# EAGLE design lighting_sign (EAGLE 9.6.2)
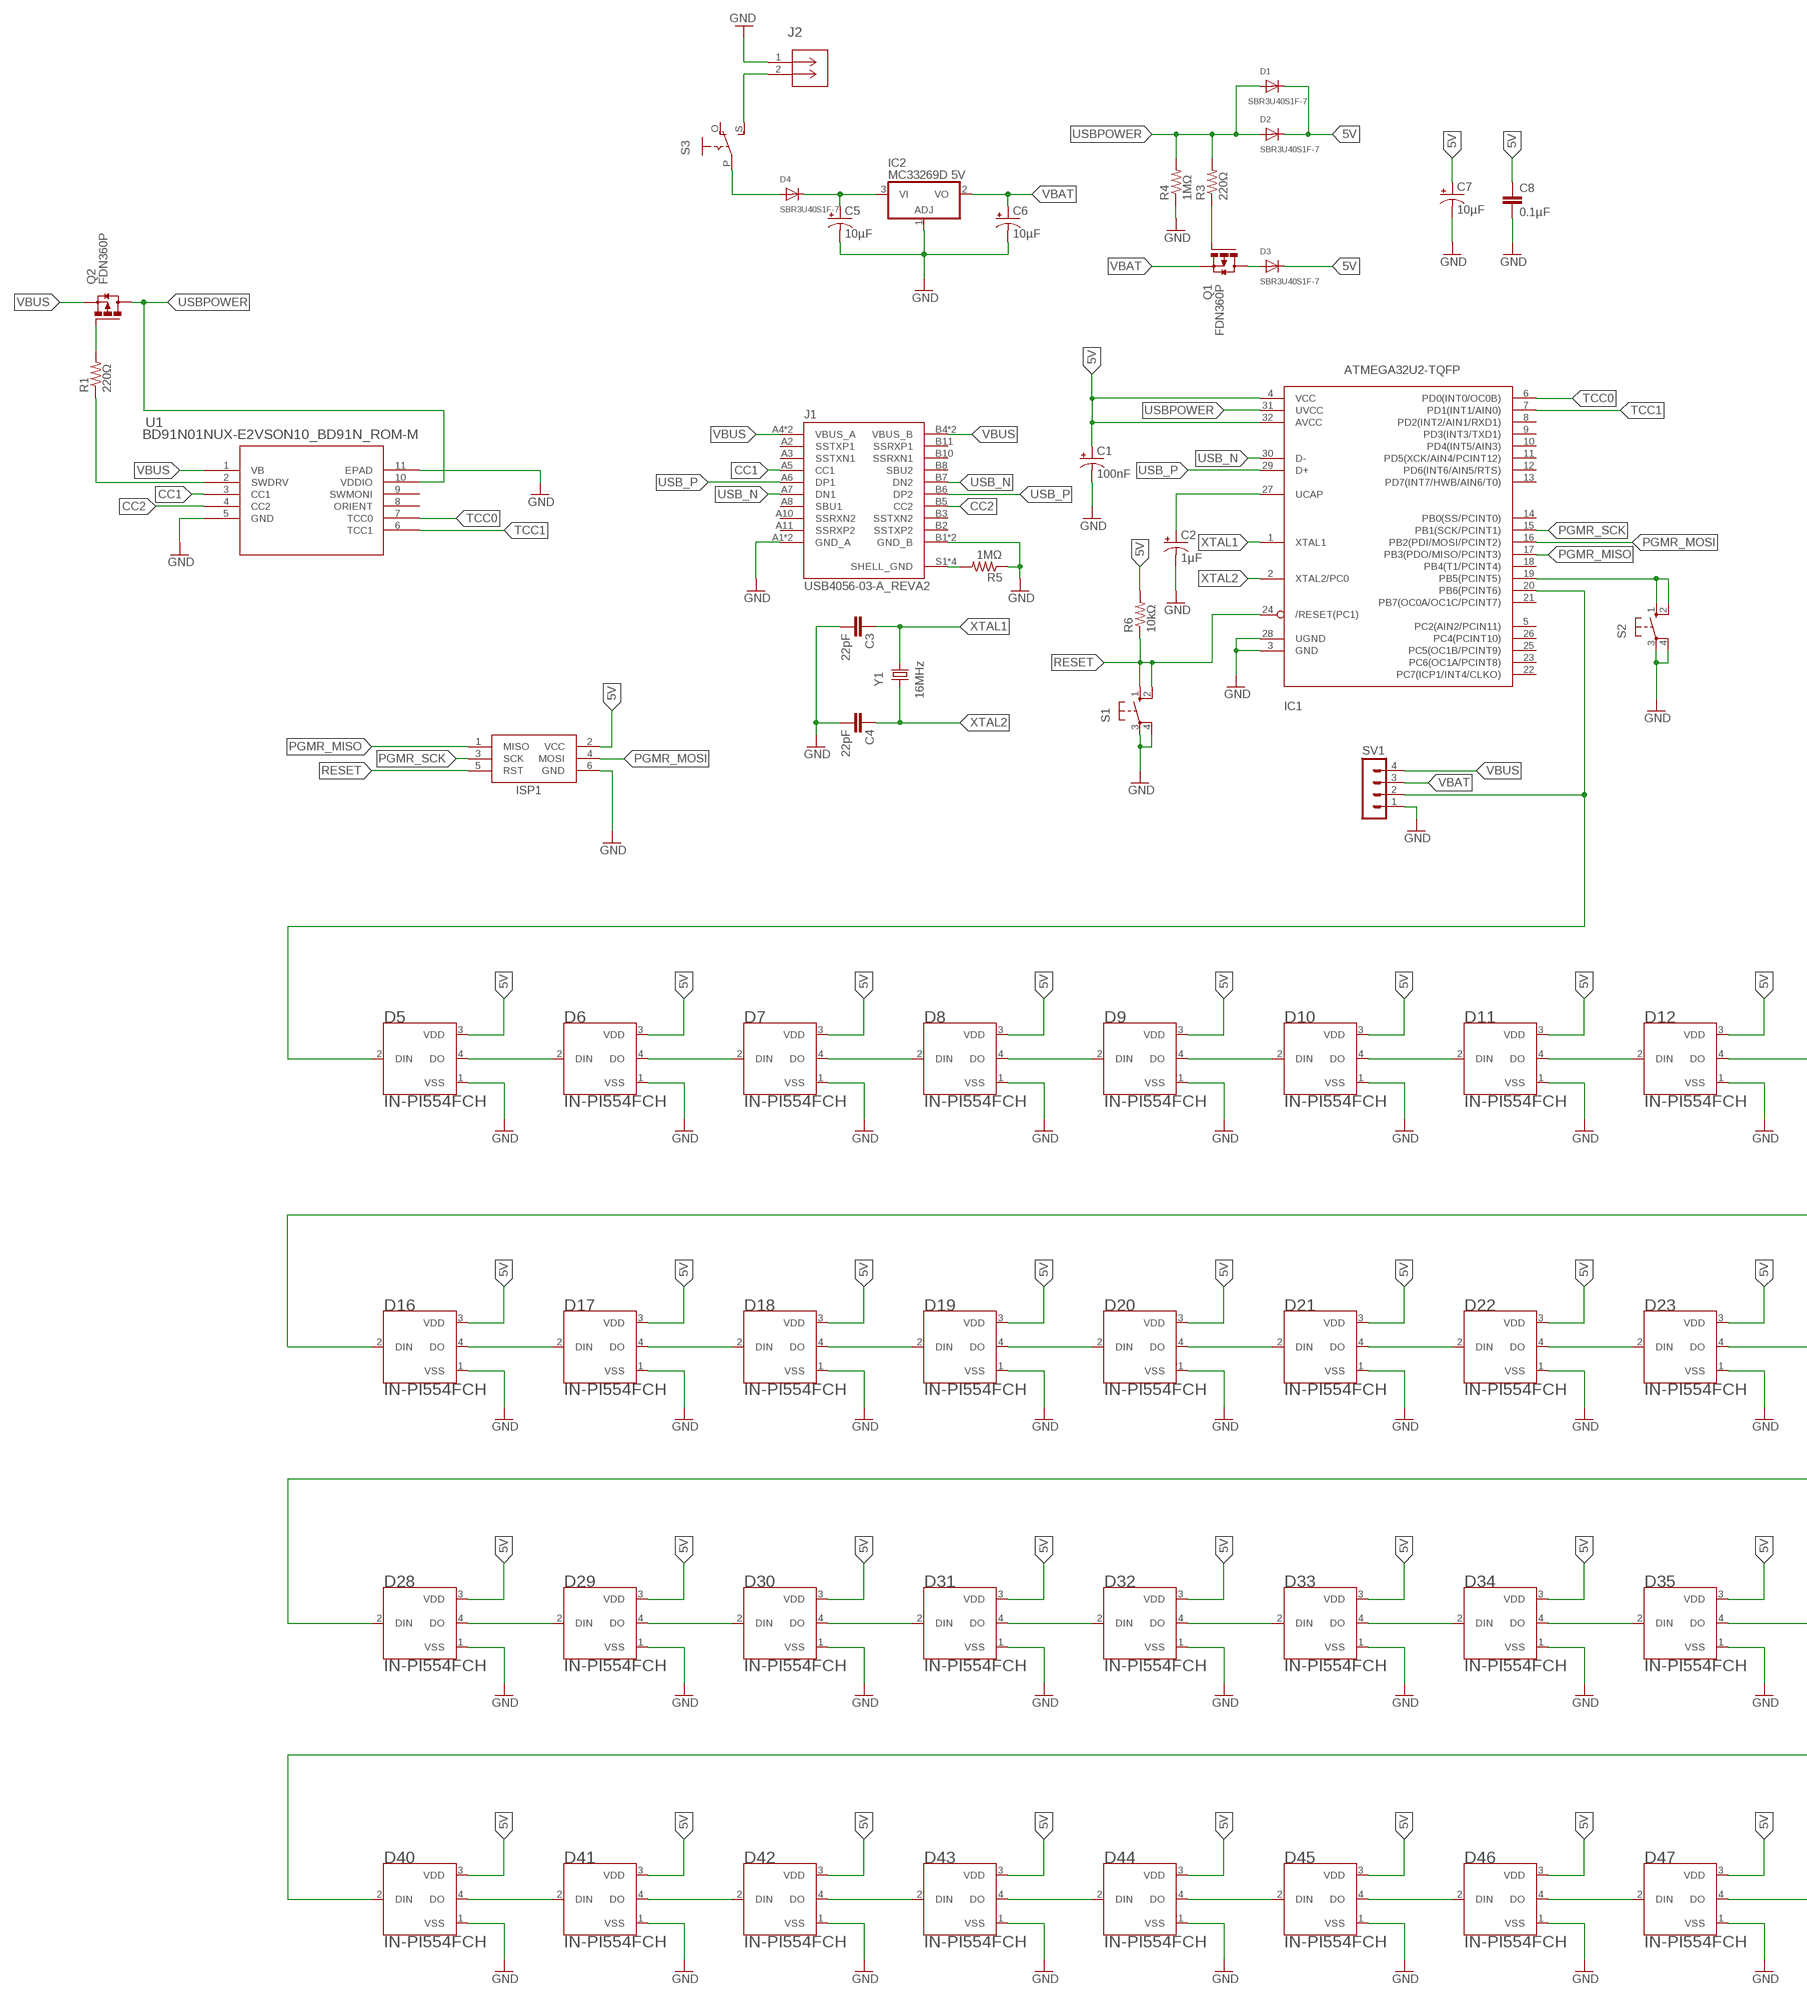
[diagram p0: schematic, sheet 1, part 1 of 2]
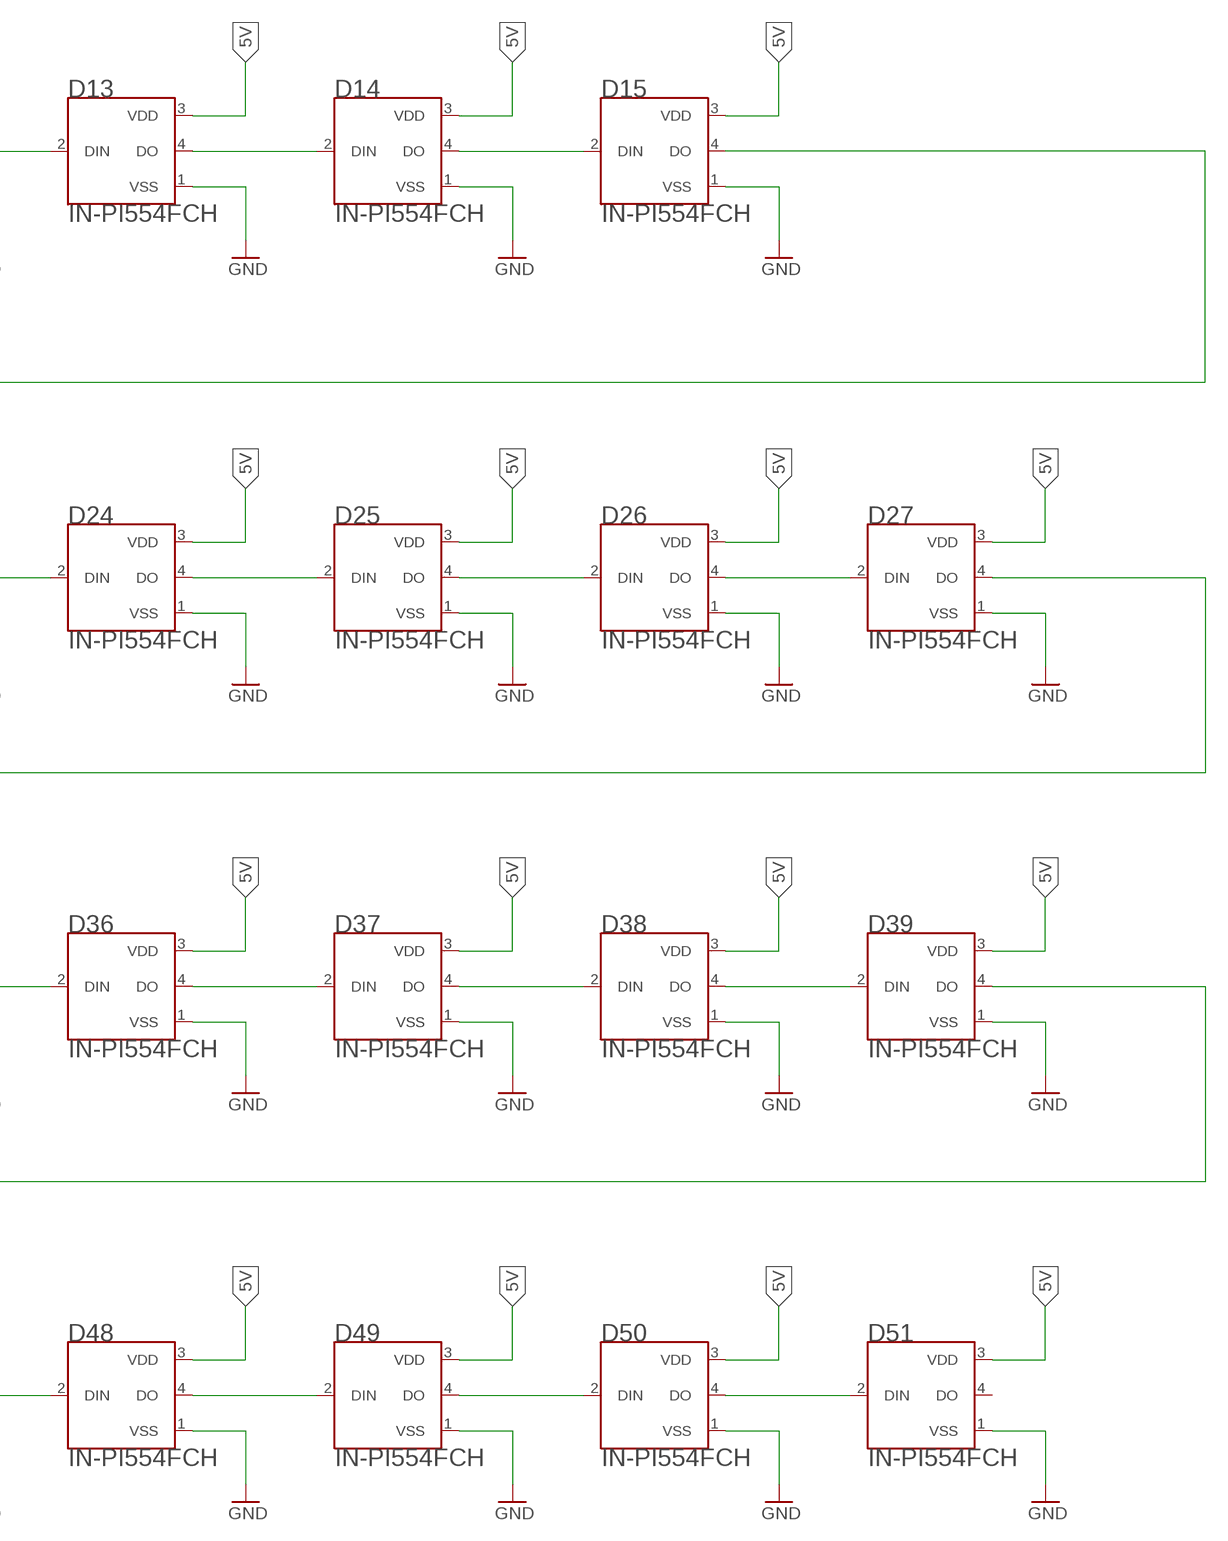
[diagram p1: schematic, sheet 1, part 2 of 2]

## Parts
C1  100nF  CPOL-USB  [PANASONIC_B]
C2  1µF  CPOL-USE2-5  [E2-5]
C3  22pF  C-EUC0402  [C0402]
C4  22pF  C-EUC0402  [C0402]
C5  10µF  CPOL-USB  [PANASONIC_B]
C6  10µF  CPOL-USB  [PANASONIC_B]
C7  10µF  CPOL-USB  [PANASONIC_B]
C8  0.1µF  C-EUC0402  [C0402]
D1  SBR3U40S1F-7  DIODESOD-123  [SOD-123]
D2  SBR3U40S1F-7  DIODESOD-123  [SOD-123]
D3  SBR3U40S1F-7  DIODESOD-123  [SOD-123]
D4  SBR3U40S1F-7  DIODESOD-123  [SOD-123]
D5  IN-PI554FCH  [LED_IN-PI554FCH]
D6  IN-PI554FCH  [LED_IN-PI554FCH]
D7  IN-PI554FCH  [LED_IN-PI554FCH]
D8  IN-PI554FCH  [LED_IN-PI554FCH]
D9  IN-PI554FCH  [LED_IN-PI554FCH]
D10  IN-PI554FCH  [LED_IN-PI554FCH]
D11  IN-PI554FCH  [LED_IN-PI554FCH]
D12  IN-PI554FCH  [LED_IN-PI554FCH]
D13  IN-PI554FCH  [LED_IN-PI554FCH]
D14  IN-PI554FCH  [LED_IN-PI554FCH]
D15  IN-PI554FCH  [LED_IN-PI554FCH]
D16  IN-PI554FCH  [LED_IN-PI554FCH]
D17  IN-PI554FCH  [LED_IN-PI554FCH]
D18  IN-PI554FCH  [LED_IN-PI554FCH]
D19  IN-PI554FCH  [LED_IN-PI554FCH]
D20  IN-PI554FCH  [LED_IN-PI554FCH]
D21  IN-PI554FCH  [LED_IN-PI554FCH]
D22  IN-PI554FCH  [LED_IN-PI554FCH]
D23  IN-PI554FCH  [LED_IN-PI554FCH]
D24  IN-PI554FCH  [LED_IN-PI554FCH]
D25  IN-PI554FCH  [LED_IN-PI554FCH]
D26  IN-PI554FCH  [LED_IN-PI554FCH]
D27  IN-PI554FCH  [LED_IN-PI554FCH]
D28  IN-PI554FCH  [LED_IN-PI554FCH]
D29  IN-PI554FCH  [LED_IN-PI554FCH]
D30  IN-PI554FCH  [LED_IN-PI554FCH]
D31  IN-PI554FCH  [LED_IN-PI554FCH]
D32  IN-PI554FCH  [LED_IN-PI554FCH]
D33  IN-PI554FCH  [LED_IN-PI554FCH]
D34  IN-PI554FCH  [LED_IN-PI554FCH]
D35  IN-PI554FCH  [LED_IN-PI554FCH]
D36  IN-PI554FCH  [LED_IN-PI554FCH]
D37  IN-PI554FCH  [LED_IN-PI554FCH]
D38  IN-PI554FCH  [LED_IN-PI554FCH]
D39  IN-PI554FCH  [LED_IN-PI554FCH]
D40  IN-PI554FCH  [LED_IN-PI554FCH]
D41  IN-PI554FCH  [LED_IN-PI554FCH]
D42  IN-PI554FCH  [LED_IN-PI554FCH]
D43  IN-PI554FCH  [LED_IN-PI554FCH]
D44  IN-PI554FCH  [LED_IN-PI554FCH]
D45  IN-PI554FCH  [LED_IN-PI554FCH]
D46  IN-PI554FCH  [LED_IN-PI554FCH]
D47  IN-PI554FCH  [LED_IN-PI554FCH]
D48  IN-PI554FCH  [LED_IN-PI554FCH]
D49  IN-PI554FCH  [LED_IN-PI554FCH]
D50  IN-PI554FCH  [LED_IN-PI554FCH]
D51  IN-PI554FCH  [LED_IN-PI554FCH]
IC1  ATMEGA32U2-TQFP  [TQFP32-08]
IC2  MC33269D 5V  MC33269D  [DPACK]
ISP1  AVRISP-BOX  [AVRISP-BOX]
J1  USB4056-03-A_REVA2  [GCT_USB4056-03-A_REVA2]
J2  BH9VPC 9V  BH9VPC  [CONN_BH9VPC_MPD]
Q1  FDN360P  [SUPER-SOT3]
Q2  FDN360P  [SUPER-SOT3]
R1  220Ω  R-US_0207/10  [0207/10]
R3  220Ω  R-US_0207/10  [0207/10]
R4  1MΩ  R-US_0207/10  [0207/10]
R5  1MΩ  R-US_0207/10  [0207/10]
R6  10kΩ  R-US_0207/10  [0207/10]
S1  10-XX  [B3F-10XX]
S2  10-XX  [B3F-10XX]
S3  EG1218S  [EG1218]
SV1  MA04-1  [MA04-1]
U1  BD91N01NUX-E2VSON10_BD91N_ROM-M  [VSON10_BD91N_ROM-M]
Y1  16MHz  CRYSTALHC49U-V  [HC49U-V]

## Nets
5V: C1.+ C7.+ C8.1 D1.C D2.C D3.C D5.3(VDD) D6.3(VDD) D7.3(VDD) D8.3(VDD) D9.3(VDD) D10.3(VDD) D11.3(VDD) D12.3(VDD) D13.3(VDD) D14.3(VDD) D15.3(VDD) D16.3(VDD) D17.3(VDD) D18.3(VDD) D19.3(VDD) D20.3(VDD) D21.3(VDD) D22.3(VDD) D23.3(VDD) D24.3(VDD) D25.3(VDD) D26.3(VDD) D27.3(VDD) D28.3(VDD) D29.3(VDD) D30.3(VDD) D31.3(VDD) D32.3(VDD) D33.3(VDD) D34.3(VDD) D35.3(VDD) D36.3(VDD) D37.3(VDD) D38.3(VDD) D39.3(VDD) D40.3(VDD) D41.3(VDD) D42.3(VDD) D43.3(VDD) D44.3(VDD) D45.3(VDD) D46.3(VDD) D47.3(VDD) D48.3(VDD) D49.3(VDD) D50.3(VDD) D51.3(VDD) IC1.4(VCC) IC1.32(AVCC) ISP1.2(VCC) R6.2
CC1: J1.A5(CC1) U1.3(CC1)
CC2: J1.B5(CC2) U1.4(CC2)
GND [GND]: C1.- C2.- C3.2 C4.2 C5.- C6.- C7.- C8.2 D5.1(VSS) D6.1(VSS) D7.1(VSS) D8.1(VSS) D9.1(VSS) D10.1(VSS) D11.1(VSS) D12.1(VSS) D13.1(VSS) D14.1(VSS) D15.1(VSS) D16.1(VSS) D17.1(VSS) D18.1(VSS) D19.1(VSS) D20.1(VSS) D21.1(VSS) D22.1(VSS) D23.1(VSS) D24.1(VSS) D25.1(VSS) D26.1(VSS) D27.1(VSS) D28.1(VSS) D29.1(VSS) D30.1(VSS) D31.1(VSS) D32.1(VSS) D33.1(VSS) D34.1(VSS) D35.1(VSS) D36.1(VSS) D37.1(VSS) D38.1(VSS) D39.1(VSS) D40.1(VSS) D41.1(VSS) D42.1(VSS) D43.1(VSS) D44.1(VSS) D45.1(VSS) D46.1(VSS) D47.1(VSS) D48.1(VSS) D49.1(VSS) D50.1(VSS) D51.1(VSS) IC1.3(GND) IC1.28(UGND) IC2.1(ADJ) ISP1.6(GND) J1.A1(GND_A) J1.A12(GND_A) J1.B1(GND_B) J1.B12(GND_B) J2.1 R4.1 R5.1 S1.3(P) S1.4(P1) S2.3(P) S2.4(P1) SV1.1 U1.5(GND) U1.11(EPAD)
N$2: D3.A Q1.3(D)
N$3: Q2.1(G) R1.2
N$4: Q1.1(G) R3.1
N$5: J2.2 S3.S
N$6: C5.+ D4.C IC2.3(VI)
N$7: D5.4(DO) D6.2(DIN)
N$8: D6.4(DO) D7.2(DIN)
N$9: D7.4(DO) D8.2(DIN)
N$10: D8.4(DO) D9.2(DIN)
N$11: D9.4(DO) D10.2(DIN)
N$12: D10.4(DO) D11.2(DIN)
N$13: D11.4(DO) D12.2(DIN)
N$14: J1.S1(SHELL_GND) J1.S2(SHELL_GND) J1.S3(SHELL_GND) J1.S4(SHELL_GND) R5.2
N$15: D5.2(DIN) IC1.20(PB6(PCINT6)) SV1.2
N$16: C2.+ IC1.27(UCAP)
N$17: D4.A S3.P
N$18: IC1.19(PB5(PCINT5)) S2.1(S) S2.2(S1)
N$19: D12.4(DO) D13.2(DIN)
N$20: D13.4(DO) D14.2(DIN)
N$21: D14.4(DO) D15.2(DIN)
N$22: D16.4(DO) D17.2(DIN)
N$23: D17.4(DO) D18.2(DIN)
N$24: D18.4(DO) D19.2(DIN)
N$25: D19.4(DO) D20.2(DIN)
N$26: D20.4(DO) D21.2(DIN)
N$27: D21.4(DO) D22.2(DIN)
N$28: D22.4(DO) D23.2(DIN)
N$29: D15.4(DO) D16.2(DIN)
N$30: D23.4(DO) D24.2(DIN)
N$31: D24.4(DO) D25.2(DIN)
N$32: D25.4(DO) D26.2(DIN)
N$33: D26.4(DO) D27.2(DIN)
N$34: D28.4(DO) D29.2(DIN)
N$35: D29.4(DO) D30.2(DIN)
N$36: D30.4(DO) D31.2(DIN)
N$37: D31.4(DO) D32.2(DIN)
N$38: D32.4(DO) D33.2(DIN)
N$39: D33.4(DO) D34.2(DIN)
N$40: D34.4(DO) D35.2(DIN)
N$41: D27.4(DO) D28.2(DIN)
N$42: D35.4(DO) D36.2(DIN)
N$43: D36.4(DO) D37.2(DIN)
N$44: D37.4(DO) D38.2(DIN)
N$45: D38.4(DO) D39.2(DIN)
N$46: D39.4(DO) D40.2(DIN)
N$47: D40.4(DO) D41.2(DIN)
N$48: D41.4(DO) D42.2(DIN)
N$49: D42.4(DO) D43.2(DIN)
N$50: D43.4(DO) D44.2(DIN)
N$51: D44.4(DO) D45.2(DIN)
N$52: D45.4(DO) D46.2(DIN)
N$53: D46.4(DO) D47.2(DIN)
N$55: D47.4(DO) D48.2(DIN)
N$56: D48.4(DO) D49.2(DIN)
N$57: D49.4(DO) D50.2(DIN)
N$58: D50.4(DO) D51.2(DIN)
N$59: R1.1 U1.2(SWDRV)
PGMR_MISO: IC1.17(PB3(PDO/MISO/PCINT3)) ISP1.1(MISO)
PGMR_MOSI: IC1.16(PB2(PDI/MOSI/PCINT2)) ISP1.4(MOSI)
PGMR_SCK: IC1.15(PB1(SCK/PCINT1)) ISP1.3(SCK)
RESET: IC1.24(/RESET(PC1)) ISP1.5(RST) R6.1 S1.1(S) S1.2(S1)
TCC0: IC1.6(PD0(INT0/OC0B)) U1.7(TCC0)
TCC1: IC1.7(PD1(INT1/AIN0)) U1.6(TCC1)
USB_N [diff pairs]: IC1.30(D-) J1.A7(DN1) J1.B7(DN2)
USB_P [diff pairs]: IC1.29(D+) J1.A6(DP1) J1.B6(DP2)
USBPOWER: D1.A D2.A IC1.31(UVCC) Q2.3(D) R3.2 R4.2 U1.10(VDDIO)
VBAT: C6.+ IC2.2(VO) Q1.2(S) SV1.3
VBUS: J1.A4(VBUS_A) J1.A9(VBUS_A) J1.B4(VBUS_B) J1.B9(VBUS_B) Q2.2(S) SV1.4 U1.1(VB)
XTAL1: C3.1 IC1.1(XTAL1) Y1.2
XTAL2: C4.1 IC1.2(XTAL2/PC0) Y1.1
Unconnected: D51.4(DO) IC1.5(PC2(AIN2/PCIN11)) IC1.8(PD2(INT2/AIN1/RXD1)) IC1.9(PD3(INT3/TXD1)) IC1.10(PD4(INT5/AIN3)) IC1.11(PD5(XCK/AIN4/PCINT12)) IC1.12(PD6(INT6/AIN5/RTS)) IC1.13(PD7(INT7/HWB/AIN6/T0)) IC1.14(PB0(SS/PCINT0)) IC1.18(PB4(T1/PCINT4)) IC1.21(PB7(OC0A/OC1C/PCINT7)) IC1.22(PC7(ICP1/INT4/CLKO)) IC1.23(PC6(OC1A/PCINT8)) IC1.25(PC5(OC1B/PCINT9)) IC1.26(PC4(PCINT10)) J1.A2(SSTXP1) J1.A3(SSTXN1) J1.A8(SBU1) J1.A10(SSRXN2) J1.A11(SSRXP2) J1.B2(SSTXP2) J1.B3(SSTXN2) J1.B8(SBU2) J1.B10(SSRXN1) J1.B11(SSRXP1) S3.O U1.8(ORIENT) U1.9(SWMONI)

## Library data of the parts
C1 C2 C5-C7 = adafruit:CPOL-US: POLARIZED CAPACITOR, American symbol
C3 C4 C8 = rcl:C-EU: CAPACITOR, European symbol; SPICEPREFIX: C
D1-D4 = adafruit:DIODE: Diode SMADIODE - SMA Surface Mount Package 20V 1A Schottky Diode Digikey: 641-1014-6-ND DO-1N4148 - Through Hole Small Current Diode SOD-123 20V 1 A (.5mV Vf) Schottky Diode - Digikey: MBRX120TPMSCT-ND SOD-323 10V 570mA (.38mV Vf, 3ns) Schottky Diode - Digikey: ZLLS410CT-ND SOD-523 30V 30mA Schottky Diode (RB751S-40TE61) - Digikey: RB751S-40TE61CT-ND SOT23-R/W - SOT23 Package (R = Solder Paste/Reflow Ovens, W = Hand-Soldering) BAT54Film 40V 300mA - Digikey: 497-7162-1-ND
D5-D51 = IN-PI554FCH:IN-PI554FCH: 5050RGB with integrated IC built in 4 PIN Viewing angle: 120 degrees; MANUFACTURER: Inolux
IC1 = adafruit:ATMEGA32U2: ATmega32u2 Pin compatible with the atmega8u2, atmega16u2 and atmega32u2 8, 16 or 32 K flash, 1K RAM, 512b EEPROM 8 bit and 16 bit timer (5 PWM total) UART, SPI (no I2C!) USB with 4 endpoints, LUFA compatible 22 I/O lines, analog comparator (no ADC!) Comes with DFU bootloader burned in!
IC2 = linear:MC33269?*: Adjustable Output Low Dropout Voltage Regulator 800 mA Source: http://www.onsemi.com/pub/Collateral/MC33269-D.PDF
ISP1 = adafruit:AVRISP: AVR ISP HEADER Standard 6 pin header for AVR programming
J1 = USB4056-03-A_REVA2:USB4056-03-A_REVA2; MANUFACTURER: GCT; MAXIMUM_PACKAGE_HEIGHT: 3.31 mm; PARTREV: A2; SNAPEDA_PN: USB4056-03-A; STANDARD: Manufacturer Recommendations
J2 = components:BH9VPC; COPYRIGHT: Copyright (C) 2024 Ultra Librarian. All rights reserved.; MANUFACTURER_PART_NUMBER: BH9VPC; MFR_NAME: Memory Protection Devices
Q1 Q2 = transistor-power:FDN360P: Single P-Channel, PowerTrench (R) MOSFET Source: http://www.fairchildsemi.com/ds/FD/FDN360P.pdf
R1 R3-R6 = adafruit:R-US_: RESISTOR, American symbol
S1 S2 = switch-omron:10-XX: OMRON SWITCH; MPN: B3F-1000; OC_FARNELL: 176432; OC_NEWARK: 36M3542
S3 = adafruit:EG1218: SLIDING SWITCH 0.1" spacing through hole, vertical SPDT slide switch http://www.ladyada.net/library/pcb/eaglelibrary.html
SV1 = con-lstb:MA04-1: PIN HEADER; OC_FARNELL: unknown; OC_NEWARK: unknown
U1 = components:BD91N01NUX-E2; COPYRIGHT: Copyright (C) 2025 Ultra Librarian. All rights reserved.; MANUFACTURER_PART_NUMBER: BD91N01NUX-E2; MFR_NAME: ROHM Semiconductor
Y1 = crystal:CRYSTAL: CRYSTAL; OC_FARNELL: 1666969; OC_NEWARK: unknown

## Net classes
1 diff pairs: width 0.203 mm
2 GND: clearance 0.254 mm to class 1

## Board
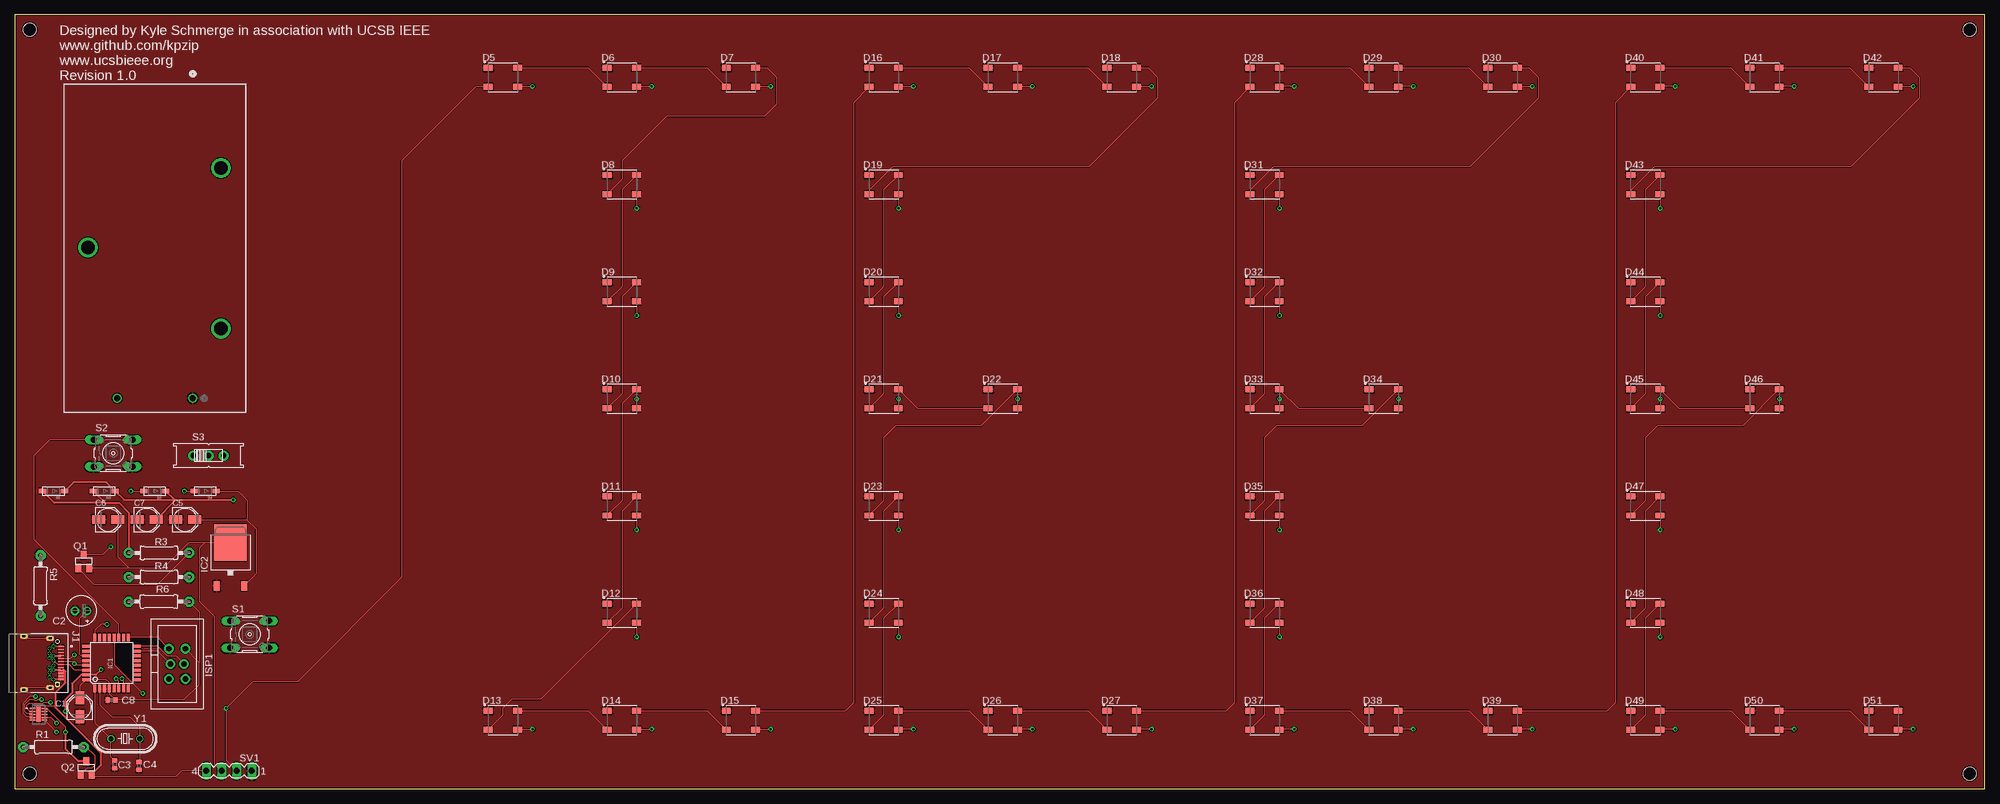
[diagram p2: board, top side]
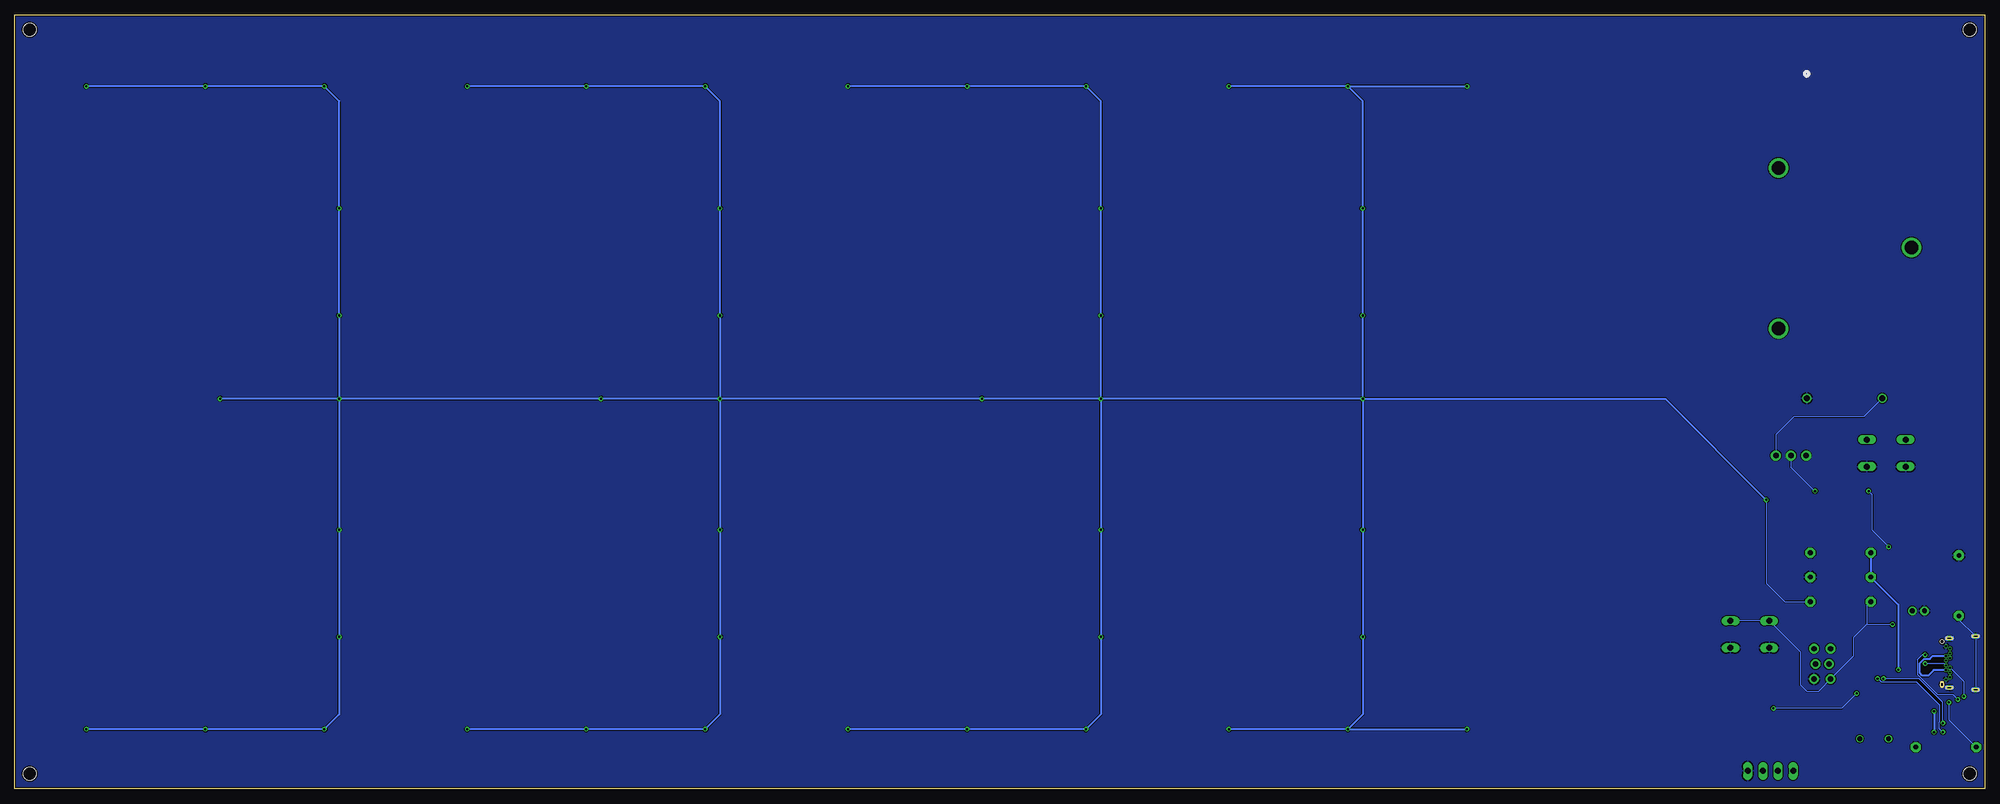
[diagram p3: board, bottom side, seen from below]

Size 331 x 130 mm. Coordinates in mm from the lower left corner, seen from the top.
Outline: 0,0 331,0 331,130 0,130 0,0
Copper layers (1*16): Top 0.035mm / dielectric 1.5mm / Bottom 0.035mm
Design rules "default *": minimum track width 6mil, minimum drill 0.35mm, track to track 6mil, track to pad 6mil, pad to pad 6mil, via to via 6mil, smd to smd 6mil, copper to edge 10mil, drill to drill 6mil, minimum pad ring 0.1mm, minimum via ring 8mil, stop-mask expansion 4mil, vias tented up to drill 0mil, thermal gap 10mil
Holes 2.2 mm at 2.5,127.5 328.5,127.5 328.5,2.5 2.5,2.5

### Footprints (pad centres in the part's own frame; a part is rotated, then mirrored left to right if it is on the bottom)
PANASONIC_B = smd 2.2 x 1.4: + 1.6,0; - -1.6,0
E2-5 = drill 0.813 pad 1.422: + -1.016,0 | drill 0.813 pad 1.422 octagon: - 1.016,0
C0402 = smd 0.7 x 0.9: 1 -0.65,0; 2 0.65,0
SOD-123 = smd 1.2 x 0.7: A 1.85,0; C -1.85,0
LED_IN-PI554FCH = smd 1.5 x 1: 1 -2.45,1.6; 2 -2.45,-1.6; 3 2.45,-1.6; 4 2.45,1.6
TQFP32-08 = smd 1.27 x 0.508: 1 -4.293,2.8; 2 -4.293,2; 3 -4.293,1.2; 4 -4.293,0.4; 5 -4.293,-0.4; 6 -4.293,-1.2; 7 -4.293,-2; 8 -4.293,-2.8; 17 4.293,-2.8; 18 4.293,-2; 19 4.293,-1.2; 20 4.293,-0.4; 21 4.293,0.4; 22 4.293,1.2; 23 4.293,2; 24 4.293,2.8 | smd 0.508 x 1.27: 9 -2.8,-4.293; 10 -2,-4.293; 11 -1.2,-4.293; 12 -0.4,-4.293; 13 0.4,-4.293; 14 1.2,-4.293; 15 2,-4.293; 16 2.8,-4.293; 25 2.8,4.293; 26 2,4.293; 27 1.2,4.293; 28 0.4,4.293; 29 -0.4,4.293; 30 -1.2,4.293; 31 -2,4.293; 32 -2.8,4.293
DPACK = smd 1 x 1.6: 1 -2.28,-4.8; 3 2.28,-4.8 | smd 5.4 x 6.2: 2 0,2.5
AVRISP-BOX = drill 0.9 pad 1.626: 1 -1.397,2.54; 2 1.397,2.54; 3 -1.143,0; 4 1.143,0; 5 -1.397,-2.54; 6 1.397,-2.54
GCT_USB4056-03-A_REVA2 = smd 0.3 x 0.9: A1 -2.75,6.2; A2 -2.25,6.2; A3 -1.75,6.2; A4 -1.25,6.2; A5 -0.75,6.2; A6 -0.25,6.2; A7 0.25,6.2; A8 0.75,6.2; A9 1.25,6.2; A10 1.75,6.2; A11 2.25,6.2; A12 2.75,6.2 | drill 0.4 pad 0.6: B1 2.8,4.99; B2 2.4,4.29; B3 1.6,4.29; B4 1.2,4.99; B5 0.8,4.29; B6 0.4,4.99; B7 -0.4,4.99; B8 -0.8,4.29; B9 -1.2,4.99; B10 -1.6,4.29; B11 -2.4,4.29; B12 -2.8,4.99 | drill 0.5 pad 0.8: S1 -4.13,4.4; S2 4.13,4.4; S3 -4.49,0; S4 4.49,0 | hole 0.65: 3.6,5.64; -3.6,5.64
CONN_BH9VPC_MPD = drill 1.016 pad 1.524: 1 0,0; 2 0,-12.7 | drill 2.286 pad 2.286: 3 -38.684,4.75; 4 -11.709,4.75; 5 -25.349,-17.602
SUPER-SOT3 = smd 1 x 1.4: 1 -0.95,-1.1; 2 0.95,-1.1; 3 0,1.1
0207/10 = drill 0.813 pad 1.676 octagon: 1 -5.08,0; 2 5.08,0
B3F-10XX = drill 1.016 long: 1 -3.251,2.261; 2 3.251,2.261; 3 -3.251,-2.261; 4 3.251,-2.261
EG1218 = drill 0.9 pad 1.676: O -2.54,0; P 0,0; S 2.54,0
MA04-1 = drill 1.016 long: 1 -3.81,0; 2 -1.27,0; 3 1.27,0; 4 3.81,0
VSON10_BD91N_ROM-M = smd 0.914 x 0.254: 1 -1.003,1; 2 -1.003,0.5; 3 -1.003,0; 4 -1.003,-0.5; 5 -1.003,-1; 6 1.003,-1; 7 1.003,-0.5; 8 1.003,0; 9 1.003,0.5; 10 1.003,1 | smd 0.737 x 2.489: 11 0,0
HC49U-V = drill 0.813: 1 -2.413,0; 2 2.413,0

### Placement (x,y rotation side)
C1  10.91,13.67 90 top
C2  11.13,29.88 180 top
C3  16.78,4.09 270 top
C4  20.85,3.83 270 top
C5  28.61,45.21 0 top
C6  15.66,45.21 0 top
C7  22.16,45.21 0 top
C8  16.26,14.91 180 top
D1  6.5,50 180 top
D2  15,50 180 top
D3  23.5,50 180 top
D4  32,50 180 top
D5  82,119.5 0 top
D6  102,119.5 0 top
D7  122,119.5 0 top
D8  102,101.5 0 top
D9  102,83.5 0 top
D10  102,65.5 0 top
D11  102,47.5 0 top
D12  102,29.5 0 top
D13  82,11.5 0 top
D14  102,11.5 0 top
D15  122,11.5 0 top
D16  146,119.5 0 top
D17  166,119.5 0 top
D18  186,119.5 0 top
D19  146,101.5 0 top
D20  146,83.5 0 top
D21  146,65.5 0 top
D22  166,65.5 0 top
D23  146,47.5 0 top
D24  146,29.5 0 top
D25  146,11.5 0 top
D26  166,11.5 0 top
D27  186,11.5 0 top
D28  210,119.5 0 top
D29  230,119.5 0 top
D30  250,119.5 0 top
D31  210,101.5 0 top
D32  210,83.5 0 top
D33  210,65.5 0 top
D34  230,65.5 0 top
D35  210,47.5 0 top
D36  210,29.5 0 top
D37  210,11.5 0 top
D38  230,11.5 0 top
D39  250,11.5 0 top
D40  274,119.5 0 top
D41  294,119.5 0 top
D42  314,119.5 0 top
D43  274,101.5 0 top
D44  274,83.5 0 top
D45  274,65.5 0 top
D46  294,65.5 0 top
D47  274,47.5 0 top
D48  274,29.5 0 top
D49  274,11.5 0 top
D50  294,11.5 0 top
D51  314,11.5 0 top
IC1  16.26,21.12 90 top
IC2  36.23,38.86 0 top
ISP1  27.27,20.97 0 top
J1  1.52,21.12 270 top
J2  29.89,65.57 270 top
Q1  11.57,38.19 0 top
Q2  12,3.5 0 top
R1  6.5,7 0 top
R3  24.2,39.62 180 top
R4  24.2,35.56 180 top
R5  4.31,34.1 270 top
R6  24.22,31.42 0 top
S1  39.47,25.93 0 top
S2  16.54,56.37 0 top
S3  32.54,55.97 0 top
SV1  35.99,3 180 top
U1  4,12.5 0 top
Y1  18.56,8.4 180 top

### Tracks (layer width: path | path; a pad name or v marks a point on that pad's centre or on a via)
5V  (via drill 0.35)
  Top 0.152: C1.+ 10.91,17.27 IC1.32 15.38,18.32 15.86,17.85 IC1.4 15.86,15.96 C8.1 28.41,14.91 31,17.5 31,21.18 | v296.5,65.5 296.5,63.95 D46.3 | v276.5,65.5 276.5,63.95 D45.3 | v104.5,65.5 104.5,63.95 D10.3 | v148.5,65.5 148.5,63.95 D21.3 | v168.5,65.5 168.5,63.95 D22.3 | v212.5,65.5 212.5,63.95 D33.3 | v232.5,65.5 232.5,63.95 D34.3 | D16.3 148.55,118 v151,118 | D17.3 168.55,118 v171,118 | D25.3 148.55,10 v151,10 | D26.3 168.55,10 v171,10 | D27.3 188.55,10 v191,10 | D37.3 212.55,10 v215,10 | D38.3 232.55,10 v235,10 | D39.3 252.55,10 v255,10 | D49.3 276.55,10 v279,10 | D50.3 296.55,10 v299,10 | D51.3 316.55,10 v319,10 | D41.3 296.55,118 v299,118 | D40.3 276.55,118 v279,118 | D28.3 212.55,118 v215,118 | D29.3 232.55,118 v235,118 | D18.3 188.55,118 v191,118 | D30.3 252.55,118 v255,118 | D42.3 316.55,118 v319,118 | D47.3 276.5,45.85 v276.5,43.5 | D48.3 276.5,27.85 v276.5,25.5 | D44.3 276.5,81.85 v276.5,79.5 | D43.3 276.5,99.85 v276.5,97.5 | D36.3 212.5,27.85 v212.5,25.5 | D35.3 212.5,45.85 v212.5,43.5 | D32.3 212.5,81.85 v212.5,79.5 | D31.3 212.5,99.85 v212.5,97.5 | D19.3 148.5,99.85 v148.5,97.5 | D20.3 148.5,81.85 v148.5,79.5 | D23.3 148.5,45.85 v148.5,43.5 | D24.3 148.5,27.85 v148.5,25.5 | D5.3 84.55,118 v87,118 | D6.3 104.55,118 v107,118 | D7.3 124.55,118 v127,118 | D8.3 104.5,99.85 v104.5,97.5 | D9.3 104.5,81.85 v104.5,79.5 | D11.3 104.5,45.85 v104.5,43.5 | D12.3 104.5,27.85 v104.5,25.5 | D14.3 104.55,10 v107,10 | D15.3 124.55,10 v127,10 | D13.3 84.55,10 v87,10 | 31,21.18 ISP1.2 | R6.2 31,29.72 31,21.18
  Top 0.305: 26.84,48.51 18.34,48.51 D2.C 15.35,51.5 9.85,51.5 D1.C | v36.69,48.51 27.5,48.51 27.07,48.51 | D3.C 26.84,48.51 | 26.84,48.51 27.07,48.51 | C7.+ 27.07,48.51
  Bottom 0.152: v36.69,48.51 v36.69,48.5 36.69,34.5 33.61,31.42 R6.2
  Bottom 0.305: v104.5,65.5 v148.5,65.5 | v148.5,65.5 v168.5,65.5 v212.5,65.5 | v212.5,65.5 v232.5,65.5 v276.5,65.5 | v276.5,65.5 v296.5,65.5 | v148.5,65.5 v148.5,79.5 v148.5,97.5 148.5,115.5 v151,118 v171,118 v191,118 | v255,118 v235,118 v215,118 212.5,115.5 v212.5,97.5 v212.5,79.5 v212.5,65.5 | v148.5,65.5 v148.5,43.5 v148.5,25.5 148.5,12.5 v151,10 v171,10 v191,10 | v212.5,65.5 v212.5,43.5 v212.5,25.5 212.5,12.5 v215,10 v235,10 v255,10 | v276.5,65.5 v276.5,43.5 v276.5,25.5 276.5,12.5 v279,10 v299,10 v319,10 | v104.5,65.5 v104.5,79.5 v104.5,97.5 104.5,115.5 v107,118 | v107,118 v127,118 | v107,118 v87,118 | v104.5,65.5 v104.5,43.5 v104.5,25.5 104.5,12.5 v107,10 | v107,10 v127,10 | v107,10 v87,10 | v36.69,48.5 53.69,65.5 v104.5,65.5 | v319,118 v299,118 v279,118 276.5,115.5 v276.5,97.5 v276.5,79.5 v276.5,65.5
CC1  (via drill 0.35)
  Top 0.152: J1.A5 9.37,21.87 v10,22.5 | U1.3 2.85,12.64 1.97,12.64 1.62,13 1.62,14.12 2.5,15 3.14,15 3.25,14.89 3.75,14.89 3.86,15 v4.5,15
  Bottom 0.152: v10,22.5 10.5,22.5 11.32,21.68 11.32,19.25 7.93,15.87 5.37,15.87 v4.5,15
CC2  (via drill 0.35)
  Top 0.152: U1.4 2.85,12.14 1.95,12.14 1.31,12.78 1.31,14.31 2.5,15.5 v3.5,15.5
  Bottom 0.152: J1.B5 3.5,18.01 v3.5,15.5
GND
  Top 0.152: J1.A12 6.56,18.37 J1.B1 | J1.A1 6.56,23.87 J1.B12
  pour Top: -6.35,-6.35 343.87,-6.35 343.87,156.68 -6.35,156.68
  pour Bottom: -6.35,156.69 -6.35,-4.13 343.85,-4.13 343.85,156.69
N$2  (via drill 0.35)
  Top 0.152: v16.12,40.64 14.77,39.29 Q1.3 | v19.5,50 D3.A
  Bottom 0.152: v16.12,40.64 18.91,43.43 18.91,49.41 v19.5,50
N$3
  Top 0.152: Q2.1 12.15,3.5 13,3.5 13.5,4 13.5,5.5 12,7 R1.2
N$4
  Top 0.152: R3.1 23.94,34.29 13.36,34.29 10.62,37.04 Q1.1
N$5
  Bottom 0.152: S3.S 35.08,59.5 32.08,62.5 20.27,62.5 J2.2
N$6
  Top 0.152: C5.+ 38.98,45.21 | IC2.3 40.55,36.1 40.55,43.64 38.98,45.21 | D4.C 37.5,50 39,48.5 39,45.24 38.98,45.21
N$7
  Top 0.152: D5.4 96.35,121.1 D6.2
N$8
  Top 0.152: D6.4 116.35,121.1 D7.2
N$9
  Top 0.152: D7.4 126.4,121.1 128,119.5 128,115 126,113 109.5,113 102,105.5 102,102.35 D8.2
N$10
  Top 0.152: D8.4 102,100.65 102,84.35 D9.2
N$11
  Top 0.152: D9.4 102,82.65 102,66.35 D10.2
N$12
  Top 0.152: D10.4 102,64.65 102,48.35 D11.2
N$13
  Top 0.152: D11.4 102,46.65 102,30.35 D12.2
N$14
  Top 0.152: J1.S2 1.88,16.99 J1.S4 | J1.S3 1.88,25.25 J1.S1
  Bottom 0.152: J1.S4 J1.S3 4.31,28.4 R5.2
N$15  (via drill 0.35)
  Top 0.152: IC1.20 16.66,20.84 v21.5,16 | SV1.2 35.5,4.76 v35.5,13.5 40,18 47.5,18 65,35.5 65,105.5 77.4,117.9 D5.2
  Bottom 0.152: v21.5,16 24,13.5 v35.5,13.5
N$16
  Top 0.152: IC1.27 11.12,22.32 10.92,22.53 10.92,28.65 C2.+
N$17  (via drill 0.35)
  Top 0.152: v28.5,50 D4.A
  Bottom 0.152: S3.P 32.54,54.04 v28.5,50
N$18
  Top 0.152: S2.2 S2.1 5.88,58.63 3.29,56.05 3.29,41.81 17.46,27.65 IC1.19
N$19
  Top 0.152: D12.4 88.35,15 83.5,15 82,13.5 82,12.35 D13.2
N$20
  Top 0.152: D13.4 96.35,13.1 D14.2
N$21
  Top 0.152: D14.4 116.35,13.1 D15.2
N$22
  Top 0.152: D16.4 150,121.1 160.35,121.1 D17.2
N$23
  Top 0.152: D17.4 180.35,121.1 D18.2
N$24
  Top 0.152: D19.2 143.55,100.55 147.5,104.5 180.5,104.5 192,116 192,119.55 190.45,121.1 D18.4
N$25
  Top 0.152: D19.4 146,100.65 146,84.35 D20.2
N$26
  Top 0.152: D20.4 146,82.65 146,66.35 D21.2
N$27
  Top 0.152: D21.4 151.65,63.9 D22.2
N$28
  Top 0.152: D22.4 162.35,61 148,61 146,59 146,48.35 D23.2
N$29
  Top 0.152: D15.4 139.6,13.1 141,14.5 141,115.35 D16.2
N$30
  Top 0.152: D23.4 146,46.65 146,30.35 D24.2
N$31
  Top 0.152: D24.4 146,28.65 146,12.35 D25.2
N$32
  Top 0.152: D25.4 160.35,13.1 D26.2
N$33
  Top 0.152: D26.4 180.35,13.1 D27.2
N$34
  Top 0.152: D28.4 224.35,121.1 D29.2
N$35
  Top 0.152: D29.4 244.35,121.1 D30.2
N$36
  Top 0.152: D31.2 207.55,100.55 211.5,104.5 244.5,104.5 256,116 256,119.55 254.45,121.1 D30.4
N$37
  Top 0.152: D31.4 210,100.65 210,84.35 D32.2
N$38
  Top 0.152: D32.4 210,82.65 210,66.35 D33.2
N$39
  Top 0.152: D33.4 215.65,63.9 D34.2
N$40
  Top 0.152: D34.4 226.35,61 212,61 210,59 210,48.35 D35.2
N$41
  Top 0.152: D27.4 203.6,13.1 205,14.5 205,115.35 D28.2
N$42
  Top 0.152: D35.4 210,46.65 210,30.35 D36.2
N$43
  Top 0.152: D36.4 210,28.65 210,12.35 D37.2
N$44
  Top 0.152: D37.4 224.35,13.1 D38.2
N$45
  Top 0.152: D38.4 244.35,13.1 D39.2
N$46
  Top 0.152: D39.4 267.6,13.1 269,14.5 269,115.35 D40.2
N$47
  Top 0.152: D40.4 288.35,121.1 D41.2
N$48
  Top 0.152: D41.4 308.35,121.1 D42.2
N$49
  Top 0.152: D43.2 271.55,100.55 275.5,104.5 308.5,104.5 320,116 320,119.55 318.45,121.1 D42.4
N$50
  Top 0.152: D43.4 274,100.65 274,84.35 D44.2
N$51
  Top 0.152: D44.4 274,82.65 274,66.35 D45.2
N$52
  Top 0.152: D45.4 279.65,63.9 D46.2
N$53
  Top 0.152: D46.4 290.35,61 276,61 274,59 274,48.35 D47.2
N$55
  Top 0.152: D47.4 274,46.65 274,30.35 D48.2
N$56
  Top 0.152: D48.4 274,28.65 274,12.35 D49.2
N$57
  Top 0.152: D49.4 288.35,13.1 D50.2
N$58
  Top 0.152: D50.4 308.35,13.1 D51.2
N$59  (via drill 0.35)
  Top 0.152: U1.2 2.5,13 2,13.5 2,14 2.39,14.39 4.75,14.39 4.86,14.5 v6,14.5
  Bottom 0.152: v6,14.5 6,11.58 R1.1
PGMR_MISO
  Top 0.152: ISP1.1 23.97,25.42 IC1.17
PGMR_MOSI
  Top 0.152: ISP1.4 27.17,22.22 25.7,22.22 23.99,23.92 IC1.16
PGMR_SCK
  Top 0.152: ISP1.3 23.98,23.12 IC1.15
RESET  (via drill 0.35)
  Top 0.152: v15.48,27.61 14.48,27.61 13.46,26.58 IC1.24
  Bottom 0.152: 19.81,27.61 22.1,25.32 22.1,22.26 25.88,18.48 ISP1.5 27.9,16.4 29.9,16.4 31,17.5 31,22.98 S1.1 S1.2 | 19.81,27.61 19.81,30.75 R6.1 | 19.81,27.61 v15.48,27.61
TCC0  (via drill 0.35)
  Top 0.152: U1.7 6,12 v7,11 | IC1.6 17.46,18.04 v17,18.5
  Bottom 0.152: v7,11 7,14.5 11,18.5 v17,18.5
TCC1  (via drill 0.35)
  Top 0.152: U1.6 v7,9.5 | IC1.7 18.26,18.24 v18,18.5
  Bottom 0.152: v7,9.5 7.61,10.11 7.61,11.25 7.5,11.36 7.5,14 11.39,17.89 17.25,17.89 17.86,18.5 v18,18.5
USB_N
  Top 0.203: J1.B7 7.16,20.87 J1.A7 9.13,20.87 10,20 11.89,20 IC1.30
USB_P  (via drill 0.35)
  Top 0.203: J1.A6 9.63,21.37 v10,21 10.28,20.72 IC1.29
  Bottom 0.203: J1.B6 6.79,21 v10,21
USBPOWER  (via drill 0.35)
  Top 0.152: U1.10 5.15,13.36 5.55,13.36 8.5,10.41 v8.5,9.5
  Top 0.305: D2.A 15.15,48 | R3.2 19.12,46.38 17.5,48 15.15,48 | v14.5,20 13.62,19.12 IC1.31 11.12,19.12 9.63,17.63 9.63,16.09 8.5,14.96 v8.5,13 | v8.5,9.5 8.5,6.75 10.65,4.6 Q2.3 | 15.15,48 6.65,48 D1.A
  Bottom 0.305: R3.2 R4.2 14.5,30.94 v14.5,20 | v8.5,13 v8.5,9.5
VBAT
  Top 0.152: Q1.2 19.16,37.09 | 19.16,37.09 25.02,37.09 29.28,41.36 32,41.36 | 32,41.36 IC2.2 | C6.+ 17.26,39 19.16,37.09 | 32,41.36 31,40.36 31,31.5 33.5,29 33.5,4.22 SV1.3
VBUS
  Top 0.152: 8,19.87 J1.A9 | U1.1 3.06,13.5 3.54,13.97 5.67,13.97 5.75,13.89 6.89,13.89 | SV1.4 28,3 27,2 13.35,2 Q2.2
  Top 0.305: Q2.2 14.45,3.9 14.45,6.05 6.89,13.61 6.89,13.89 6.89,16.22 8.48,17.8 8.48,19.65 8.26,19.87 8,19.87 | J1.B9 6.56,22.37 J1.A4 | J1.A9 6.56,19.87 J1.B4
  Bottom 0.305: J1.B4 8.58,19.92 9.5,19 10.44,19 10.94,19.5 10.94,21.06 10.18,21.82 9.22,21.82 8.71,22.32 J1.B9
XTAL1
  Top 0.152: IC1.1 13.46,11.1 Y1.2 16.15,5.37 C3.1
XTAL2
  Top 0.152: IC1.2 14.26,14.11 16.25,12.11 19.3,12.11 20.97,10.44 Y1.1 20.97,4.48 C4.1

### Text on the board
tSilk: Designed by Kyle Schmerge in association with UCSB IEEE / www.github.com/kpzip / www.ucsbieee.org / Revision 1.0